# EAGLE design McPiFace-Status-V2 (EAGLE 7.4.0)
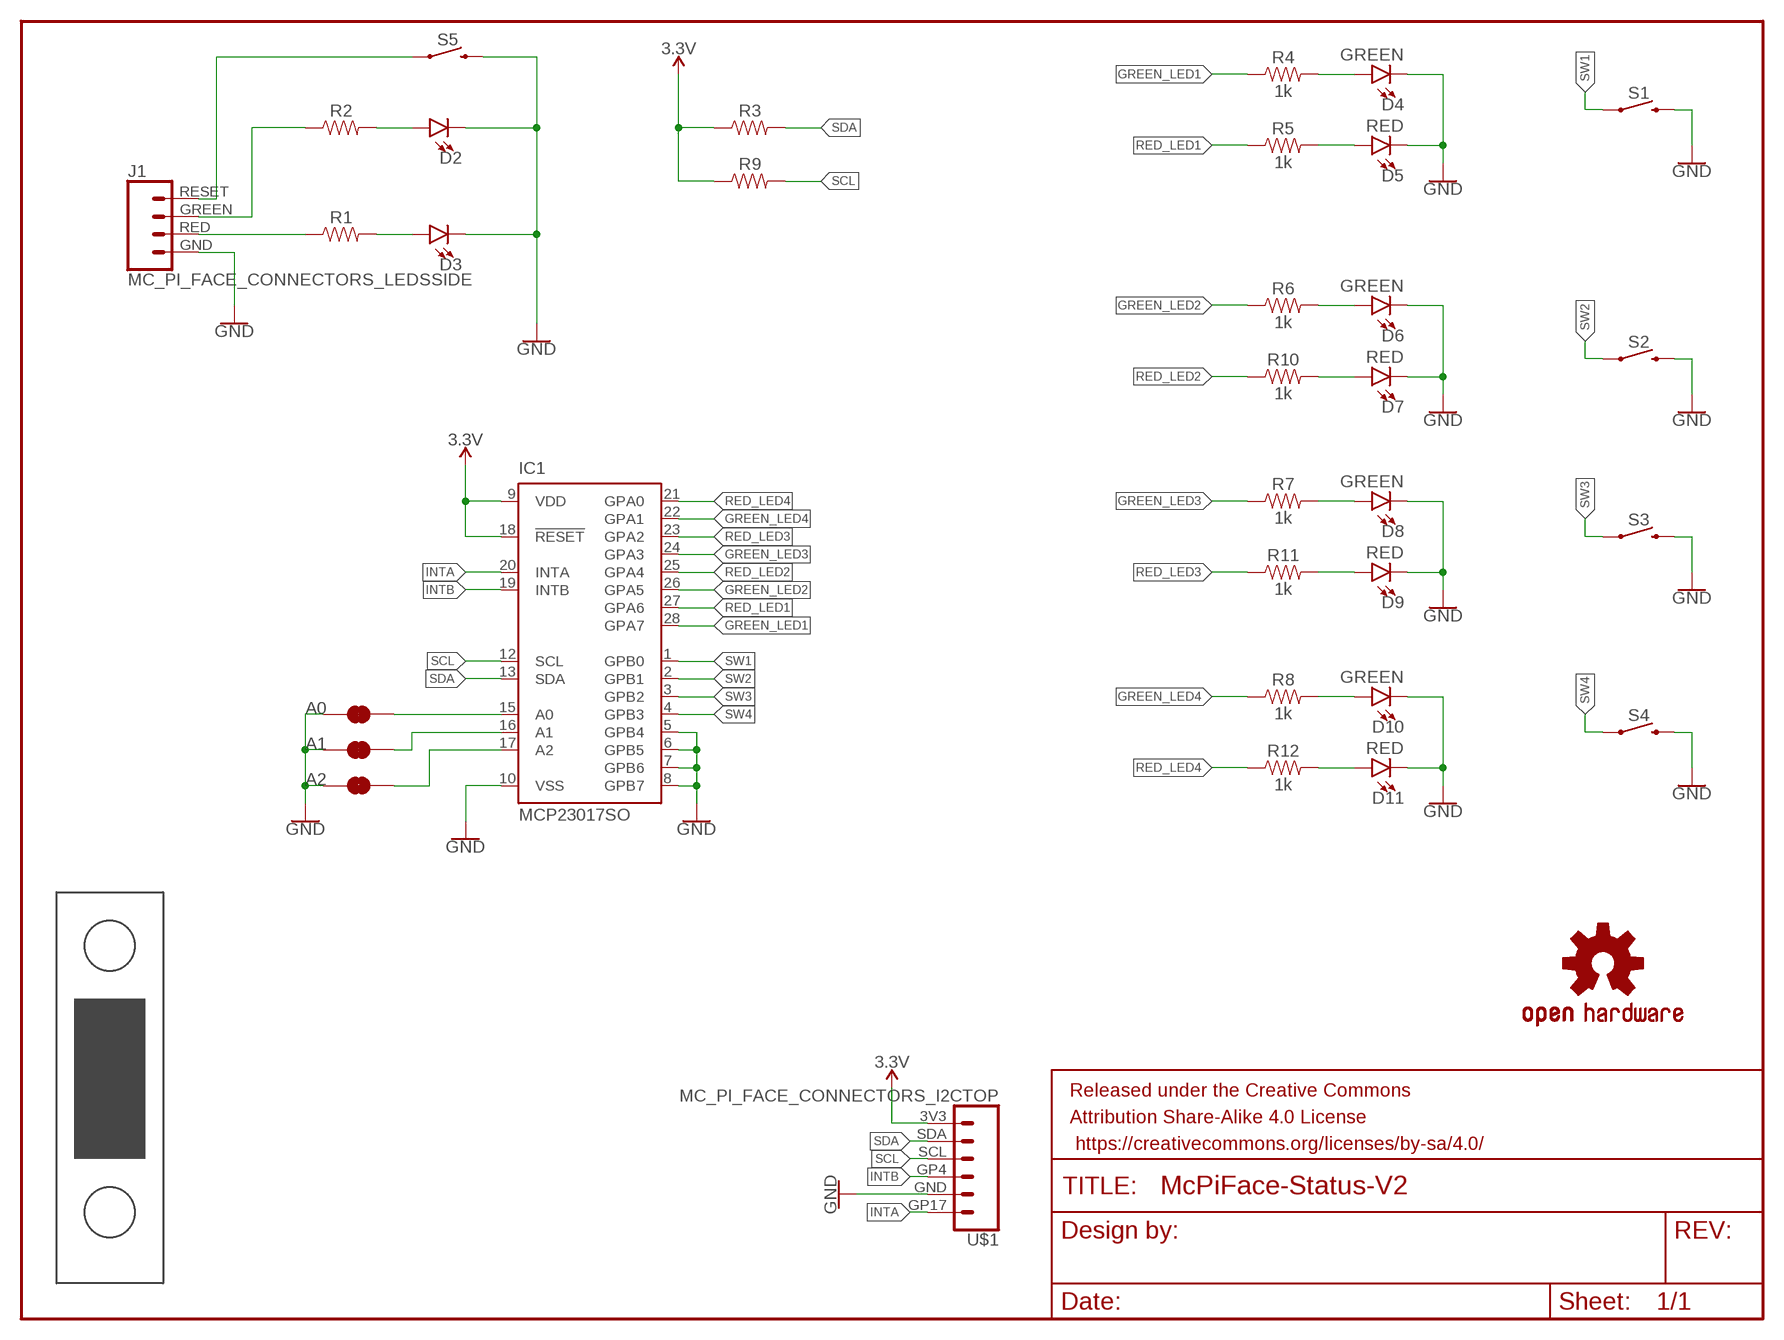
[diagram p0: schematic, sheet 1]

## Parts
A0  JUMPER-SMT_2_NC_TRACE_SILK  [SMT-JUMPER_2_NC_TRACE_SILK]
A1  JUMPER-SMT_2_NC_TRACE_SILK  [SMT-JUMPER_2_NC_TRACE_SILK]
A2  JUMPER-SMT_2_NC_TRACE_SILK  [SMT-JUMPER_2_NC_TRACE_SILK]
D2  LEDLED-1206-BOTTOM-2.0MM-GREEN  [LED-1206-BOTTOM-2.0MM]
D3  LEDLED-1206-BOTTOM-2.0MM-RED  [LED-1206-BOTTOM-2.0MM]
D4  GREEN  LEDLED-1206-BOTTOM-2.0MM-GREEN  [LED-1206-BOTTOM-2.0MM]
D5  RED  LEDLED-1206-BOTTOM-2.0MM-RED  [LED-1206-BOTTOM-2.0MM]
D6  GREEN  LEDLED-1206-BOTTOM-2.0MM-GREEN  [LED-1206-BOTTOM-2.0MM]
D7  RED  LEDLED-1206-BOTTOM-2.0MM-RED  [LED-1206-BOTTOM-2.0MM]
D8  GREEN  LEDLED-1206-BOTTOM-2.0MM-GREEN  [LED-1206-BOTTOM-2.0MM]
D9  RED  LEDLED-1206-BOTTOM-2.0MM-RED  [LED-1206-BOTTOM-2.0MM]
D10  GREEN  LEDLED-1206-BOTTOM-2.0MM-GREEN  [LED-1206-BOTTOM-2.0MM]
D11  RED  LEDLED-1206-BOTTOM-2.0MM-RED  [LED-1206-BOTTOM-2.0MM]
FP1  MC_PI_FACE_PANELDOUBLE  [MC_PI_DOUBLE_FACE]
FRAME1  FRAME-LETTER  [CREATIVE_COMMONS]
IC1  MCP23017SO  [SO28W]
J1  MC_PI_FACE_CONNECTORS_LEDSSIDE  [JST-4-SH-1.0MM-SIDE]
LOGO1  OSHW-LOGOL  [OSHW-LOGO-L]
R1  RESISTOR0805  [0805]
R2  RESISTOR0805  [0805]
R3  RESISTOR0805  [0805]
R4  1k  RESISTOR0805  [0805]
R5  1k  RESISTOR0805  [0805]
R6  1k  RESISTOR0805  [0805]
R7  1k  RESISTOR0805  [0805]
R8  1k  RESISTOR0805  [0805]
R9  RESISTOR0805  [0805]
R10  1k  RESISTOR0805  [0805]
R11  1k  RESISTOR0805  [0805]
R12  1k  RESISTOR0805  [0805]
S1  MOMENTARY-SWITCH-SPSTTACKTILE_SWITCH_PTH_6.0MM_NO_TOP_RESIST  [TACTILE_SWITCH_PTH_6.0MM_NO_TOP_RESIST]
S2  MOMENTARY-SWITCH-SPSTTACKTILE_SWITCH_PTH_6.0MM_NO_TOP_RESIST  [TACTILE_SWITCH_PTH_6.0MM_NO_TOP_RESIST]
S3  MOMENTARY-SWITCH-SPSTTACKTILE_SWITCH_PTH_6.0MM_NO_TOP_RESIST  [TACTILE_SWITCH_PTH_6.0MM_NO_TOP_RESIST]
S4  MOMENTARY-SWITCH-SPSTTACKTILE_SWITCH_PTH_6.0MM_NO_TOP_RESIST  [TACTILE_SWITCH_PTH_6.0MM_NO_TOP_RESIST]
S5  MOMENTARY-SWITCH-SPSTTACKTILE_SWITCH_PTH_6.0MM_NO_TOP_RESIST  [TACTILE_SWITCH_PTH_6.0MM_NO_TOP_RESIST]
U$1  MC_PI_FACE_CONNECTORS_I2CTOP  [JST-6-SH-1.0MM-TOP]

## Nets
3.3V: IC1.9(VDD) IC1.18(!RESET) R3.1 R9.1 U$1.3V3
GND: A0.1 A1.1 A2.1 D2.C D3.C D4.C D5.C D6.C D7.C D8.C D9.C D10.C D11.C IC1.5(GPB4) IC1.6(GPB5) IC1.7(GPB6) IC1.8(GPB7) IC1.10(VSS) J1.GND S1.3 S2.3 S3.3 S4.3 S5.3 U$1.GND
GREEN_LED1: IC1.28(GPA7) R4.1
GREEN_LED2: IC1.26(GPA5) R6.1
GREEN_LED3: IC1.24(GPA3) R7.1
GREEN_LED4: IC1.22(GPA1) R8.1
INTA: IC1.20(INTA) U$1.GP17
INTB: IC1.19(INTB) U$1.GP4
N$1: D4.A R4.2
N$2: J1.RESET S5.1
N$3: D2.A R2.2
N$4: D3.A R1.2
N$5: J1.RED R1.1
N$6: J1.GREEN R2.1
N$8: D6.A R6.2
N$10: D10.A R8.2
N$11: D8.A R7.2
N$12: D5.A R5.2
N$13: D7.A R10.2
N$14: D9.A R11.2
N$15: D11.A R12.2
N$18: A0.2 IC1.15(A0)
N$19: A1.2 IC1.16(A1)
N$20: A2.2 IC1.17(A2)
RED_LED1: IC1.27(GPA6) R5.1
RED_LED2: IC1.25(GPA4) R10.1
RED_LED3: IC1.23(GPA2) R11.1
RED_LED4: IC1.21(GPA0) R12.1
SCL: IC1.12(SCL) R9.2 U$1.SCL
SDA: IC1.13(SDA) R3.2 U$1.SDA
SW1: IC1.1(GPB0) S1.1
SW2: IC1.2(GPB1) S2.1
SW3: IC1.3(GPB2) S3.1
SW4: IC1.4(GPB3) S4.1

## Library data of the parts
A0 A1 A2 = SparkFun-Jumpers:JUMPER-SMT_2_NC_TRACE: Normally closed trace jumper This jumper has a trace between two pads so it's normally closed (NC). Use a razor knife to open the connection. For best results follow the IPC guidelines for cutting traces: Cutout at least 0.063 mm (0.005 in). Remove all loose material to clean up the cut area. Seal the cut with an approved epoxy. Reapply solder to reclose the connection.
D2 D4 D6 D8 D10 = ThingySticks:LED: LED (Generic) Standard schematic elements and footprints for 5mm, 3mm, 1206, and 0603 sized LEDs. Generic LEDs with no color specified.; COLOR: Green; FARNELL: 2217905; FORWARD_VOLTAGE: 2.1
D3 D5 D7 D9 D11 = ThingySticks:LED: LED (Generic) Standard schematic elements and footprints for 5mm, 3mm, 1206, and 0603 sized LEDs. Generic LEDs with no color specified.; COLOR: Hyper Red; FARNELL: 2217903; FORWARD_VOLTAGE: 1.95
FP1 = McPiFace:MC_PI_FACE_PANEL
FRAME1 = SparkFun-Aesthetics:FRAME-LETTER: Schematic Frame - Letter Standard 8.5x11 US Letter frame
IC1 = McPiFace:MCP23017: http://ww1.microchip.com/downloads/en/DeviceDoc/21952a.pdf Source: http://ww1.microchip.com/downloads/en/DeviceDoc/21952a.pdf MCP23017T-E/SO - I/O Expander, 16bit, 1.7 MHz, I2C, 1.8 V, 5.5 V, SOIC Manufacturer Part No: MCP23017T-E/SO Farnell Order Code: 2851557 1+ 0.93 25+ 0.772; COST: 0.772; FARNELL: 2851557; FARNELL-ALT: 1332087
J1 = McPiFace:MC_PI_FACE_CONNECTORS_LEDS; FARNELL: 1830839; MFG: SM04B-SRSS-TB(LF)(SN)
LOGO1 = SparkFun-Aesthetics:OSHW-LOGO: Open-Source Hardware (OSHW) Logo This logo indicates the piece of hardware it is found on incorporates a OSHW license and/or adheres to the definition of open source hardware found here: http://freedomdefined.org/OSHW
R1-R12 = SparkFun-Resistors:RESISTOR: Generic Resistor Package
S1 S5 = ThingySticks:MOMENTARY-SWITCH-SPST: Momentary Switch (Pushbutton) - SPST Normally-open (NO) SPST momentary switches (buttons, pushbuttons). Variants PTH-12MM - 12mm square, through-hole Momentary Pushbutton Switch - 12mm Square <https://www.sparkfun.com/products/9190> (COM-09190) PTH-6.0MM, PTH-6.0MM-KIT - 6.0mm square, through-hole Mini Pushbutton Switch <https://www.sparkfun.com/products/97> (COM-00097) KIT package intended for soldering kit's - only one side of pads' copper is exposed. PTH-RIGHT-ANGLE-KIT - Right-angle, through-hole Right Angle Tactile Button <https://www.sparkfun.com/products/10791> - Used on SparkFun BigTime Watch Kit <https://www.sparkfun.com/products/11734> SMD-12MM - 12mm square, surface-mount Tactile Button - SMD (12mm) <https://www.sparkfun.com/products/12993> (COM-12993) Used on SparkFun PicoBoard <https://www.sparkfun.com/products/11888> SMD-4.5MM - 4.5mm Square Trackball Switch Used on SparkFun Blackberry Trackballer Breakout <https://www.sparkfun.com/products/13169> SMD-4.6MMX2.8MM - 4.60mm x 2.80mm, surface mount Used on SparkFun SAMD21 Mini Breakout <https://www.sparkfun.com/products/13664> SMD-5.2MM, SMD-5.2-REDUNDANT - 5.2mm square, surface-mount Mini Pushbutton Switch - SMD <https://www.sparkfun.com/products/8720> (COM-08720) Used on Arduino Pro Mini <https://www.sparkfun.com/products/11114> REDUNDANT package connects both switch circuits together SMD-6.0X3.5MM - 6.0 x 3.5mm, surface mount Momentary Reset Switch SMD <https://www.sparkfun.com/products/8229> (COM-08229) SMD-6.2MM-TALL - 6.2mm square, surface mount Tactile Button - SMD (6mm) <https://www.sparkfun.com/products/12992> Used on SparkFun Digital Sandbox <https://www.sparkfun.com/products/12651> SMD-RIGHT-ANGLE - Right-angle, surface mount Used on SparkFun Block for Intel® Edison - Arduino <https://www.sparkfun.com/products/13036>; FARNELL: 2435162; FARNELL-2: 1555982; FARNELL-LONG: 2533101
S2-S4 = ThingySticks:MOMENTARY-SWITCH-SPST: Momentary Switch (Pushbutton) - SPST Normally-open (NO) SPST momentary switches (buttons, pushbuttons). Variants PTH-12MM - 12mm square, through-hole Momentary Pushbutton Switch - 12mm Square <https://www.sparkfun.com/products/9190> (COM-09190) PTH-6.0MM, PTH-6.0MM-KIT - 6.0mm square, through-hole Mini Pushbutton Switch <https://www.sparkfun.com/products/97> (COM-00097) KIT package intended for soldering kit's - only one side of pads' copper is exposed. PTH-RIGHT-ANGLE-KIT - Right-angle, through-hole Right Angle Tactile Button <https://www.sparkfun.com/products/10791> - Used on SparkFun BigTime Watch Kit <https://www.sparkfun.com/products/11734> SMD-12MM - 12mm square, surface-mount Tactile Button - SMD (12mm) <https://www.sparkfun.com/products/12993> (COM-12993) Used on SparkFun PicoBoard <https://www.sparkfun.com/products/11888> SMD-4.5MM - 4.5mm Square Trackball Switch Used on SparkFun Blackberry Trackballer Breakout <https://www.sparkfun.com/products/13169> SMD-4.6MMX2.8MM - 4.60mm x 2.80mm, surface mount Used on SparkFun SAMD21 Mini Breakout <https://www.sparkfun.com/products/13664> SMD-5.2MM, SMD-5.2-REDUNDANT - 5.2mm square, surface-mount Mini Pushbutton Switch - SMD <https://www.sparkfun.com/products/8720> (COM-08720) Used on Arduino Pro Mini <https://www.sparkfun.com/products/11114> REDUNDANT package connects both switch circuits together SMD-6.0X3.5MM - 6.0 x 3.5mm, surface mount Momentary Reset Switch SMD <https://www.sparkfun.com/products/8229> (COM-08229) SMD-6.2MM-TALL - 6.2mm square, surface mount Tactile Button - SMD (6mm) <https://www.sparkfun.com/products/12992> Used on SparkFun Digital Sandbox <https://www.sparkfun.com/products/12651> SMD-RIGHT-ANGLE - Right-angle, surface mount Used on SparkFun Block for Intel® Edison - Arduino <https://www.sparkfun.com/products/13036>
U$1 = McPiFace:MC_PI_FACE_CONNECTORS_I2C

## Board
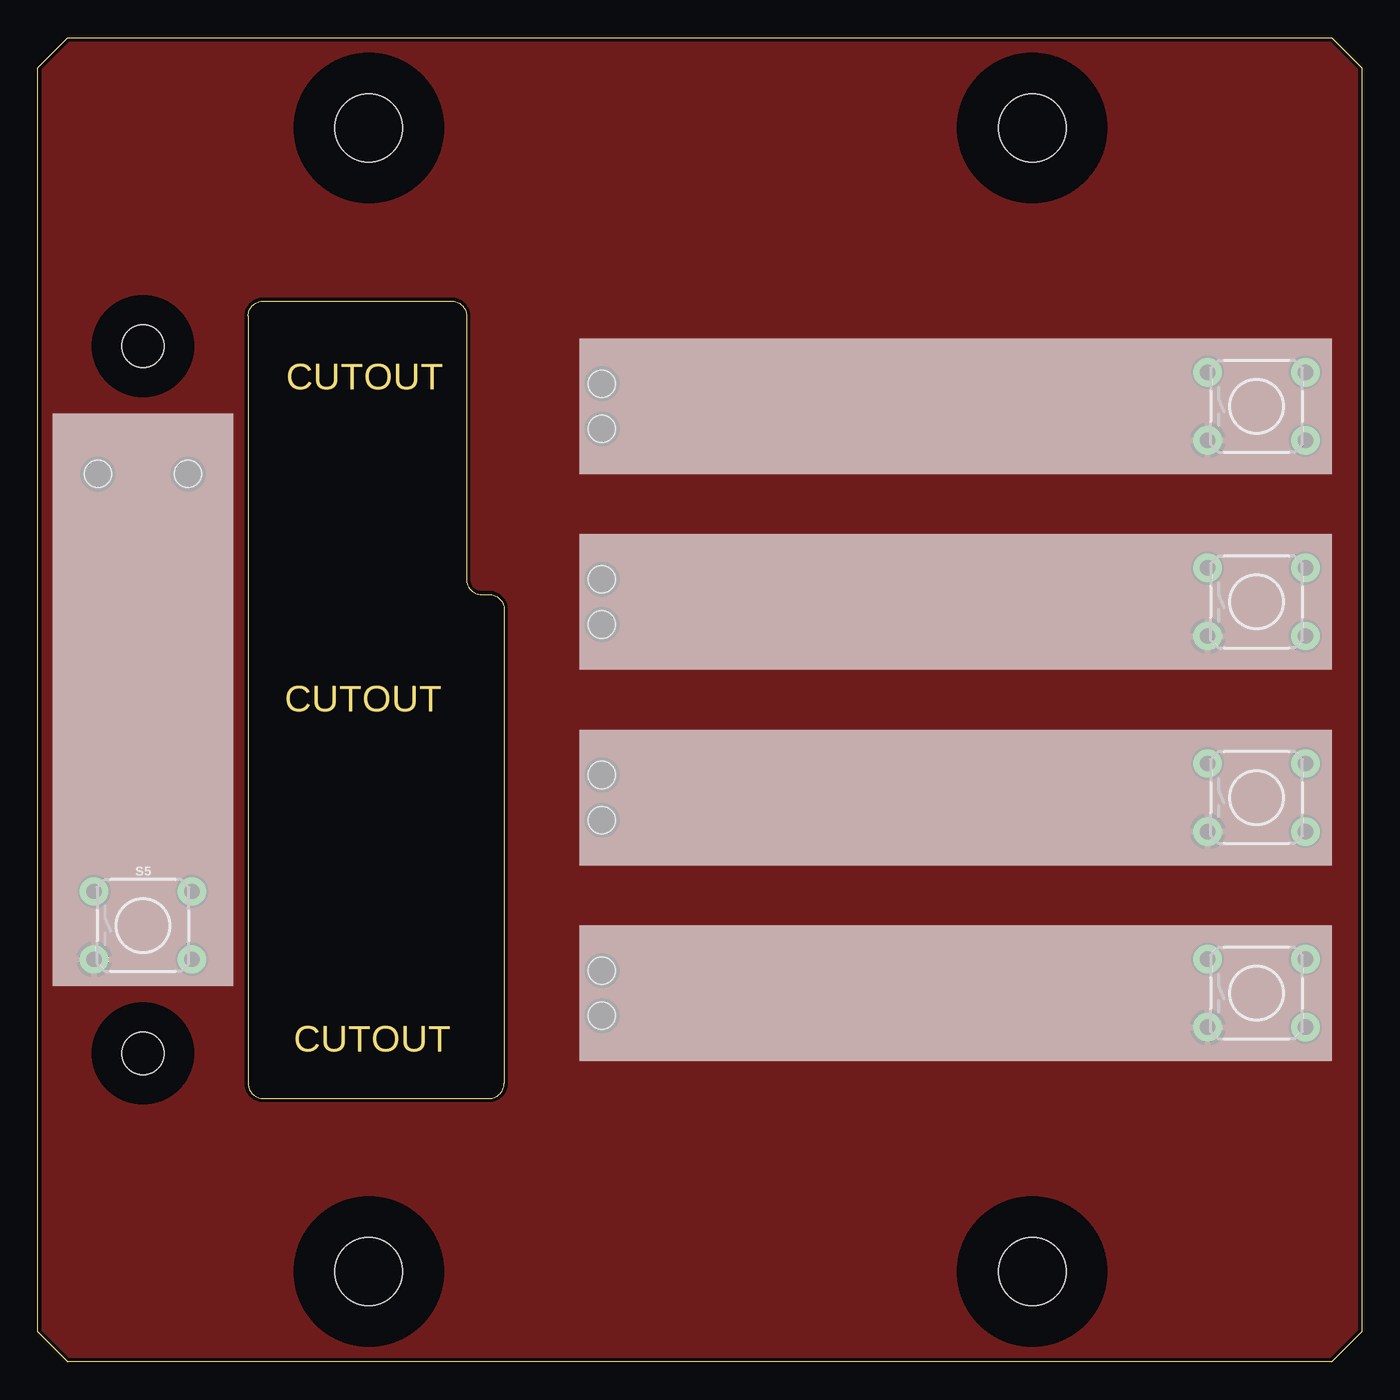
[diagram p1: board, top side]
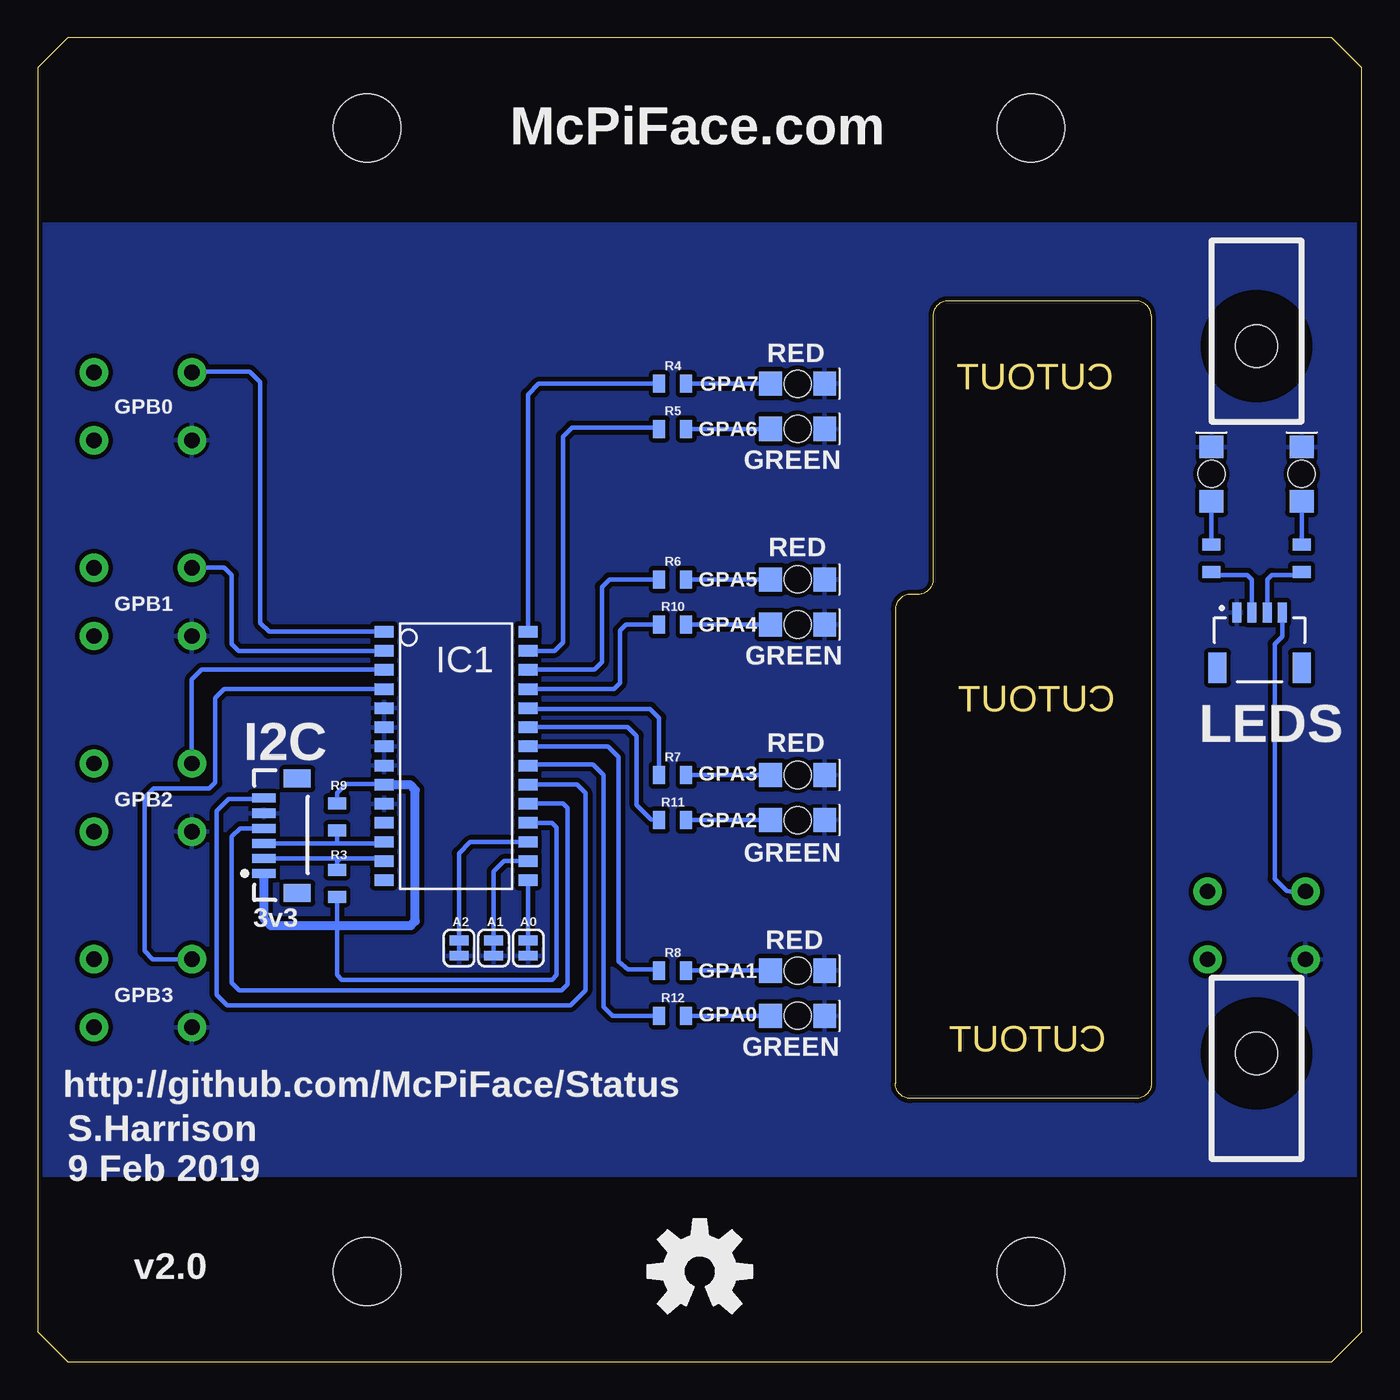
[diagram p2: board, bottom side, seen from below]

Size 88 x 88 mm. Coordinates in mm from the lower left corner, seen from the top.
Copper layers (1*16): Top 0.035mm / dielectric 1.5mm / Bottom 0.035mm
Design rules "dirt_cheap_dirty_boards.v1.1": minimum track width 6mil, minimum drill 12mil, track to track 6mil, track to pad 6mil, pad to pad 6mil, via to via 6mil, smd to smd 0mil, copper to edge 10mil, drill to drill 10mil, minimum pad ring 10mil, minimum via ring 6mil, stop-mask expansion 2mil, vias tented up to drill 25mil, thermal gap 10mil
tRestrict: area 17,77 to 27,87; area 17,1 to 27,11; area 61.1,1 to 71.1,11; area 61.1,77 to 71.1,87

### Footprints (pad centres in the part's own frame; a part is rotated, then mirrored left to right if it is on the bottom)
SMT-JUMPER_2_NC_TRACE_SILK = smd 0.635 x 1.27: 1 -0.508,0; 2 0.508,0
LED-1206-BOTTOM-2.0MM = smd 1.5 x 1.6: A -1.8,0; C 1.8,0 | hole 1.8: 0,0
MC_PI_DOUBLE_FACE = hole 2.8: 7,20.5; 7,67.5 | hole 4.5: 22,82; 66.1,82; 22,6; 66.1,6
SO28W = smd 0.762 x 1.27: 1 -7.62,-4.78; 2 -6.35,-4.78; 3 -5.08,-4.78; 4 -3.81,-4.78; 5 -2.54,-4.78; 6 -1.27,-4.78; 7 0,-4.78; 8 1.27,-4.78; 9 2.54,-4.78; 10 3.81,-4.78; 11 5.08,-4.78; 12 6.35,-4.78; 13 7.62,-4.78; 14 8.89,-4.78; 15 8.89,4.78; 16 7.62,4.78; 17 6.35,4.78; 18 5.08,4.78; 19 3.81,4.78; 20 2.54,4.78; 21 1.27,4.78; 22 0,4.78; 23 -1.27,4.78; 24 -2.54,4.78; 25 -3.81,4.78; 26 -5.08,4.78; 27 -6.35,4.78; 28 -7.62,4.78
JST-4-SH-1.0MM-SIDE = smd 0.6 x 1.35: GND -1.5,0; GREEN 0.5,0; RED -0.5,0; RESET 1.5,0 | smd 1.2 x 2: NC1 2.8,-3.675; NC2 -2.8,-3.675
0805 = smd 0.8 x 1.2: 1 -0.9,0; 2 0.9,0
TACTILE_SWITCH_PTH_6.0MM_NO_TOP_RESIST = drill 1.016 pad 1.88: 1 -3.251,2.261; 2 3.251,2.261; 3 -3.251,-2.261; 4 3.251,-2.261
JST-6-SH-1.0MM-TOP = smd 0.6 x 1.55: 3V3 -2.54,1.27; GND 1.46,1.27; GP4 0.46,1.27; GP17 2.46,1.27; SCL -0.54,1.27; SDA -1.54,1.27 | smd 1.2 x 1.8: P$1 -3.84,-0.955; P$2 3.76,-0.955

### Placement (x,y rotation side)
A0  55.4,27.5 90 bottom
A1  57.7,27.5 90 bottom
A2  60,27.5 90 bottom
D2  4,59 90 bottom
D3  10,59 90 bottom
D4  37.5,65 0 bottom
D5  37.5,62 0 bottom
D6  37.5,52 0 bottom
D7  37.5,49 0 bottom
D8  37.5,39 0 bottom
D9  37.5,36 0 bottom
D10  37.5,26 0 bottom
D11  37.5,23 0 bottom
FP1  0,0 0 top
FRAME1  6.2,-18 0 top  (outside the outline)
IC1  60.2,40.9 270 bottom
J1  6.8,49.8 0 bottom
LOGO1  44,6 0 bottom
R1  10,53.4 90 bottom
R2  4,53.4 90 bottom
R3  68.1,31.8 90 bottom
R4  45.8,65 0 bottom
R5  45.8,62 0 bottom
R6  45.8,52 0 bottom
R7  45.8,39 0 bottom
R8  45.8,26 0 bottom
R9  68.1,36.2 270 bottom
R10  45.8,49 0 bottom
R11  45.8,36 0 bottom
R12  45.8,23 0 bottom
S1  81,63.5 0 top
S2  81,50.5 0 top
S3  81,37.5 0 top
S4  81,24.5 0 top
S5  7,29 0 top
U$1  71.7,35 90 bottom

### Tracks (layer width: path | path; a pad name or v marks a point on that pad's centre or on a via)
3.3V
  Bottom 0.305: R9.1 68.1,37.8 67.5,38.4 65.02,38.4 IC1.9 | R3.1 68.1,29 68.1,25.7 67.8,25.4 53.8,25.4 53.5,25.7 53.5,35.5 53.8,35.8 55.44,35.8
  Bottom 0.61: U$1.3V3 72.97,29.47 72.5,29 68.1,29 63.2,29 62.9,29.3 62.9,38 63.26,38.36 IC1.9 | 55.44,35.8 IC1.18
GND
  pour Top: -1,88.5 88.7,88.5 88.7,-1 -1,-1
  pour Bottom (isolate 0.305): -1,88.5 88.7,88.5 88.7,-1 -1,-1
GREEN_LED1
  Bottom 0.305: IC1.28 55.42,64.28 54.7,65 R4.1
GREEN_LED2
  Bottom 0.305: R6.1 50,52 50.5,51.5 50.5,46.5 51,46 55.4,46 IC1.26
GREEN_LED3
  Bottom 0.305: R7.1 46.67,39.17 46.7,39.5 46.7,42.8 47.3,43.4 55.38,43.4 IC1.24
GREEN_LED4
  Bottom 0.305: IC1.22 50.1,40.9 49.4,40.2 49.4,26.6 48.77,26.07 46.77,26.07 R8.1 46.84,26
INTA
  Bottom 0.305: IC1.20 52.16,38.36 51.6,37.8 51.6,24.7 52.6,23.7 75.4,23.7 76.1,24.4 76.1,36.6 75.3,37.4 73.03,37.4 U$1.GP17
INTB
  Bottom 0.305: U$1.GP4 74.54,35.46 75.1,34.9 75.1,25.2 74.6,24.7 53.2,24.7 52.8,25.1 52.8,36.8 53.1,37.1 IC1.19
N$1
  Bottom 0.305: R4.2 D4.A
N$2
  Bottom 0.305: J1.RESET 5.3,48.2 5.8,47.7 5.8,32.1 5,31.3 4.4,31.2 4.3,31.3 3.79,31.3 S5.1
N$3
  Bottom 0.305: R2.2 D2.A
N$4
  Bottom 0.305: R1.2 D3.A
N$5
  Bottom 0.305: J1.RED 7.3,52 7.6,52.3 9.6,52.3 R1.1
N$6
  Bottom 0.305: J1.GREEN 6.3,52 6,52.3 4.3,52.3 4,52.6 R2.1
N$8
  Bottom 0.305: D6.A R6.2
N$10
  Bottom 0.305: R8.2 D10.A
N$11
  Bottom 0.305: D8.A R7.2
N$12
  Bottom 0.305: D5.A R5.2
N$13
  Bottom 0.305: R10.2 D7.A
N$14
  Bottom 0.305: R11.2 D9.A
N$15
  Bottom 0.305: R12.2 D11.A
N$18
  Bottom 0.305: IC1.15 55.42,28.03 A0.2
N$19
  Bottom 0.305: IC1.16 57.02,33.28 57.7,32.6 A1.2
N$20
  Bottom 0.305: IC1.17 59.25,34.55 60,33.8 A2.2
RED_LED1
  Bottom 0.305: IC1.27 53.65,47.25 53.1,47.8 53.1,61.5 52.5,62.1 46.8,62.1 R5.1
RED_LED2
  Bottom 0.305: R10.1 48.9,49 49.3,48.6 49.3,45.1 49.7,44.7 IC1.25
RED_LED3
  Bottom 0.305: R11.1 47.25,36.05 48.2,37 48.2,41.6 48.8,42.2 55.39,42.2 IC1.23
RED_LED4
  Bottom 0.305: R12.1 49.79,22.99 50.4,23.6 50.4,39 51.1,39.7 55.35,39.7 IC1.21
SCL
  Bottom 0.305: U$1.SCL 68,34.46 | 68,34.46 65.07,34.46 IC1.12 | R9.2 68.1,34.56 68,34.46
SDA
  Bottom 0.305: U$1.SDA 67.9,33.46 | 67.9,33.46 65.16,33.46 IC1.13 | R3.2 68.1,33.26 67.9,33.46
SW1
  Bottom 0.305: IC1.1 72.62,48.52 73.2,49.1 73.2,65.1 73.9,65.8 77.71,65.8 S1.1
SW2
  Bottom 0.305: IC1.2 74.65,47.25 75.1,47.7 75.1,52.3 75.6,52.8 77.71,52.8 S2.1
SW3
  Bottom 0.305: S3.1 77.75,45.35 77.1,46 65,46 IC1.3
SW4
  Bottom 0.305: S4.1 80.36,26.76 80.9,27.3 80.9,37.5 80.3,38.1 76.6,38.1 76.2,38.5 76.2,44.1 75.6,44.7 IC1.4

### Text on the board
bNames: McPiFace.com | RED | GPA7 | GPB0 | GPA6 | GREEN | RED | GPA5 | GPB1 | GREEN | GPA4 | RED | LEDS | I2C | GPA3 | GPB2 | GPA2 | GREEN | RED | 3v3 | GPA1 | GPB3 | GPA0 | GREEN | http://github.com/McPiFace/Status | S.Harrison / 9 Feb 2019 | v2.0
tStop: STATUS